# Altium project PCB2A.PrjPcb
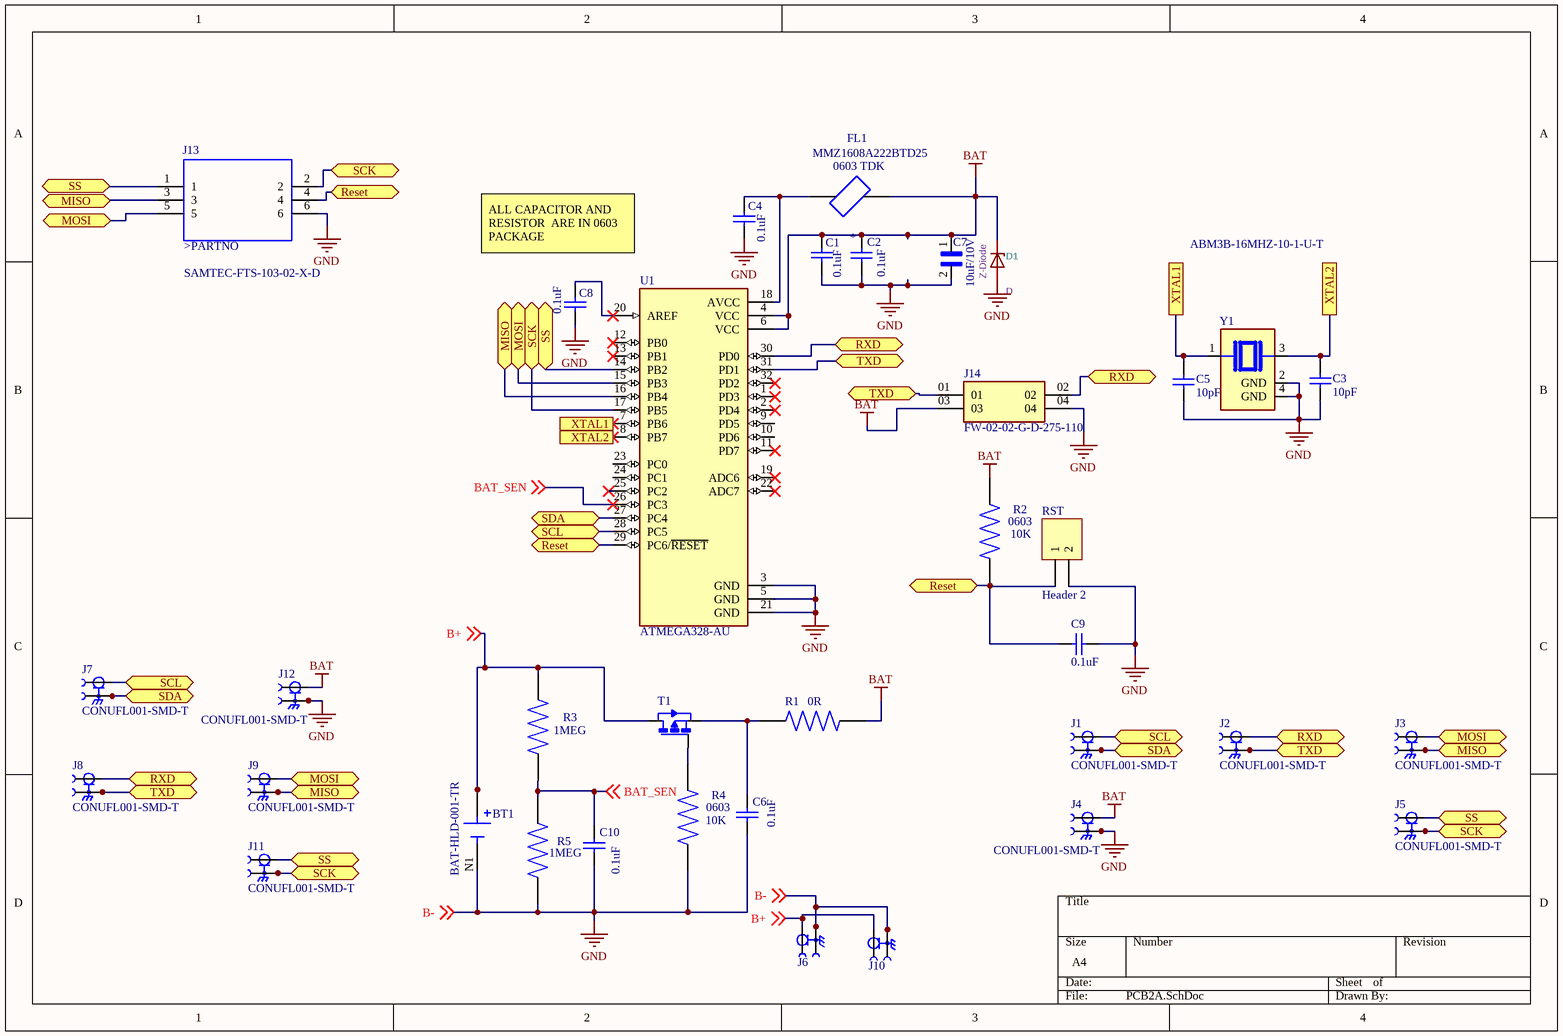
[diagram p0: PCB2A.SchDoc]
1 sheet, 36 parts. Net scope: flat (ports and power ports of the same name join across sheets).
Board file: PCB2A.PcbDoc

## Sheet PCB2A.SchDoc
size A4; SheetNumber: 1; SheetTotal: 1

### Parts
BT1  BAT-HLD-001-TR  [BAT_BAT-HLD-001-TR]
C1  value 0.1uF  [CAPC1608X90]  (hidden comment: Cap)
C2  value 0.1uF  [CAPC1608X90]  (hidden comment: Cap)
C3  value 10pF  [CAPC1608X90]  (hidden comment: Cap)
C4  value 0.1uF  [CAPC1608X90]  (hidden comment: Cap)
C5  value 10pF  [CAPC1608X90]  (hidden comment: Cap)
C6  value 0.1uF  [CAPC1608X90]  (hidden comment: Cap)
C7  10uF/10V  [CAPC1608X90]
C8  value 0.1uF  [CAPC1608X90]  (hidden comment: Cap)
C9  value 0.1uF  [CAPC1608X90]  (hidden comment: Cap)
C10  value 0.1uF  [CAPC1608X90]  (hidden comment: Cap)
D1  value Z-Diode  Reference: D  [SOD-323F]  (hidden comment: Zener-Diode)
FL1  MMZ1608A222BTD25  Package: 0603 TDK  [BEADC1608X95N]
J1  CONUFL001-SMD-T  [LINX_CONUFL001-SMD-T]
J2  CONUFL001-SMD-T  [LINX_CONUFL001-SMD-T]
J3  CONUFL001-SMD-T  [LINX_CONUFL001-SMD-T]
J4  CONUFL001-SMD-T  [LINX_CONUFL001-SMD-T]
J5  CONUFL001-SMD-T  [LINX_CONUFL001-SMD-T]
J6  CONUFL001-SMD-T  [LINX_CONUFL001-SMD-T]  (value not drawn)
J7  CONUFL001-SMD-T  [LINX_CONUFL001-SMD-T]
J8  CONUFL001-SMD-T  [LINX_CONUFL001-SMD-T]
J9  CONUFL001-SMD-T  [LINX_CONUFL001-SMD-T]
J10  CONUFL001-SMD-T  [LINX_CONUFL001-SMD-T]  (value not drawn)
J11  CONUFL001-SMD-T  [LINX_CONUFL001-SMD-T]
J12  CONUFL001-SMD-T  [LINX_CONUFL001-SMD-T]
J13  SAMTEC-FTS-103-02-X-D  [SAMTEC-FTS-103-02-X-D]  (value not drawn)
J14  FW-02-02-G-D-275-110  [SAMTEC_FW-02-02-G-D-275-110]
R1  value 0R  [RESC1608X55N]  (hidden comment: 10K)
R2  Package: 0603  [RESC1608X55N]  (hidden comment: 10K)
R3  value 1MEG  [RESC1608X55N]  (hidden comment: 10K)
R4  Package: 0603  [RESC1608X55N]  (hidden comment: 10K)
R5  value 1MEG  [RESC1608X55N]  (hidden comment: 10K)
RST  Header 2  [HDR1X2]
T1  SSM3J338R,LF  [SSM3J338R,LF]  (value not drawn)
U1  ATMEGA328-AU  [QFP80P900X900X120-32N]
Y1  ABM3B-16MHZ-10-1-U-T  [XTAL_ABM3B-16MHZ-10-1-U-T]

### Ports
MISO (bidir), MOSI (bidir), Reset (bidir), RXD (bidir), SCK (bidir), SCL (bidir), SDA (bidir), SS (bidir), TXD (bidir), XTAL1, XTAL2

### Nets
BAT: C1.2 C2.2 C7.1 D1.K FL1.2 J4.1 J12.1 J14.03 R1.1 R2.2 U1.4(VCC) U1.6(VCC)
GND: BT1.N1(NEG) C1.1 C2.1 C3.1 C4.1 C5.1 C6.1 C7.2 C8.1 C9.1 C10.1 D1.A J4.2 J4.3 J6.2 J6.3 J10.2 J10.3 J12.2 J12.3 J13.6 J14.04 R4.1 R5.1 RST.2 U1.3(GND) U1.5(GND) U1.21(GND) Y1.2(GND) Y1.4(GND) ; off-sheet B-  [also labelled B-]
B+: BT1.P1(POS) BT1.P2(POS) J6.1 J10.1 R3.2 T1.P$3(D) ; off-sheet B+
BAT_SEN: C10.2 R3.1 R5.2 U1.26(PC3) ; off-sheet BAT_SEN
NetC3_2: C3.2 U1.8(PB7) Y1.3 ; port XTAL2
NetC4_2: C4.2 FL1.1 U1.18(AVCC)
NetC5_2: C5.2 U1.7(PB6) Y1.1 ; port XTAL1
NetC6_2: C6.2 R1.2 T1.P$2(S)
NetC8_2: C8.2 U1.20(AREF)
NetC9_2: C9.2 J13.4 R2.1 RST.1 U1.29(PC6/~{RESET}) ; port Reset
NetJ1_1: J1.1 J7.1 U1.28(PC5) ; port SCL
NetJ1_2: J1.2 J1.3 J7.2 J7.3 U1.27(PC4) ; port SDA
NetJ2_1: J2.1 J8.1 J14.02 U1.30(PD0) ; port RXD
NetJ2_2: J2.2 J2.3 J8.2 J8.3 J14.01 U1.31(PD1) ; port TXD
NetJ3_1: J3.1 J9.1 J13.5 U1.15(PB3) ; port MOSI
NetJ3_2: J3.2 J3.3 J9.2 J9.3 J13.3 U1.16(PB4) ; port MISO
NetJ5_1: J5.1 J11.1 J13.1 U1.14(PB2) ; port SS
NetJ5_2: J5.2 J5.3 J11.2 J11.3 J13.2 U1.17(PB5) ; port SCK
NetR4_2: R4.2 T1.P$1(G)

Not connected (* = marked no-connect by the designer): U1 1(PD3)* 2(PD4)* 9(PD5) 10(PD6) 11(PD7)* 12(PB0)* 13(PB1)* 19(ADC6)* 22(ADC7)* 23(PC0) 24(PC1) 25(PC2)* 32(PD2)*

### Notes on the sheet
- ALL CAPACITOR AND RESISTOR  ARE IN 0603 PACKAGE
- (in symbol SAMTEC-FTS-103-02-X-D) >PARTNO

### Library data of the parts
BT1 = BAT-HLD-001-TR: Battery Retainer Coin, 20.0mm 1 Cell SMD (SMT) Tab; Availability: Unavailable; Package: None; MP: BAT-HLD-001-TR; Value: *; Price: None
C1-C6 C8-C10 = Cap: Capacitor; Published: 8-Jun-2000; LatestRevisionDate: 17-Jul-2002; LatestRevisionNote: Re-released for DXP Platform.; PackageReference: RAD-0.3; Publisher: Altium Limited; PackageDescription: Radial Cap, Thru-Hole; 2 Leads; 0.3 in Pin Spacing
C7 = CC0603MRX5R7BB106: CAP CER 10UF 16V X5R 0603; Package: None; Price: None; Value: *; MP: CC0603MRX5R7BB106; Availability: Unavailable
D1 = Zener-Diode: ki_keywords: Zener TVS unidirectional Diode; ki_description: Zener Diode, TVS-unidirectional Diode; Datasheet: https://diotec.com/de/produktliste/Z.html
FL1 = MMZ1608A222BTD25: Ferrite Beads Multi-Layer 2.2KOhm 25% 100MHz 0.2A 0.8Ohm DCR 0603 Automotive T/R; MF: TDK; SnapEDA_Link: https://www.snapeda.com/parts/MMZ1608A222BTD25/TDK/view-part/2727619/?ref=snap; Availability: Good; MP: MMZ1608A222BTD25; Price: None; Purchase-URL: https://pricing.snapeda.com/search/part/MMZ1608A222BTD25/?ref=eda; Value: *; Check_prices: https://www.snapeda.com/parts/MMZ1608A222BTD25/TDK/view-part/2727619/?ref=eda
J1-J12 = CONUFL001-SMD-T: U.FL (UMCC) Connector Jack, Male Pin 50Ohm Surface Mount Solder; MF: Linx; Price: None; MP: CONUFL001-SMD-T; Package: None; Value: *; Check_prices: https://www.snapeda.com/parts/CONUFL001-SMD-T/Linx/view-part/?ref=eda; Availability: Unavailable; SnapEDA_Link: https://www.snapeda.com/parts/CONUFL001-SMD-T/Linx/view-part/?ref=snap
J13 = SAMTEC-FTS-103-02-X-D: MF: Samtec; MP: SAMTEC-FTS-103-02-X-D; Package: None; Price: None; Availability: Unavailable; Value: *
J14 = FW-02-02-G-D-275-110: Conn Board Stacker HDR 4 POS 1.27mm Solder ST Top Entry Thru-Hole Layer; MF: Samtec; SnapEDA_Link: https://www.snapeda.com/parts/FW-02-02-G-D-275-110/Samtec/view-part/?ref=snap; Package: None; Value: *; MP: FW-02-02-G-D-275-110; Check_prices: https://www.snapeda.com/parts/FW-02-02-G-D-275-110/Samtec/view-part/?ref=eda
R1-R5 = RT0603FRD0710KL: Res Thin Film 0603 10K Ohm 1% 0.1W(1/10W) Â±25ppm/C Molded SMD Paper T/R; MF: Yageo; MP: RT0603FRD0710KL; Price: None; Purchase-URL: https://pricing.snapeda.com/search/part/RT0603FRD0710KL/?ref=eda; Check_prices: https://www.snapeda.com/parts/RT0603FRD0710KL/Yageo/view-part/?ref=eda; Availability: In Stock; SnapEDA_Link: https://www.snapeda.com/parts/RT0603FRD0710KL/Yageo/view-part/?ref=snap
  R1 R3 R5: Package: 0603
  R2 R4: Value: 10K
RST = Header 2: Header, 2-Pin; LatestRevisionDate: 17-Jul-2002; LatestRevisionNote: Re-released for DXP Platform.; Publisher: Altium Limited
T1 = SSM3J338R,LF: P-Channel 12 V 6A (Ta) 1W (Ta) Surface Mount SOT-23F; MF: Toshiba Semiconductor and Storage; Availability: In Stock; SnapEDA_Link: https://www.snapeda.com/parts/SSM3J338R,LF/Toshiba+Semiconductor+and+Storage/view-part/?ref=snap; Value: *; MP: SSM3J338R,LF; Package: SOT-23-3 Toshiba Semiconductor and Storage; Price: None; Purchase-URL: https://pricing.snapeda.com/search/part/SSM3J338R,LF/?ref=eda; Check_prices: https://www.snapeda.com/parts/SSM3J338R,LF/Toshiba+Semiconductor+and+Storage/view-part/?ref=eda
U1 = ATMEGA328-AU: AVR AVRÂ® ATmega Microcontroller IC 8-Bit 20MHz 32KB (16K x 16) FLASH 32-TQFP (7x7); MF: Microchip; Check_prices: https://www.snapeda.com/parts/ATMEGA328-AU/Microchip/view-part/?ref=eda; Value: *; Availability: In Stock; MP: ATMEGA328-AU; Price: None; Package: TQFP-32 Microchip; SnapEDA_Link: https://www.snapeda.com/parts/ATMEGA328-AU/Microchip/view-part/?ref=snap; Purchase-URL: https://pricing.snapeda.com/search/part/ATMEGA328-AU/?ref=eda
Y1 = ABM3B-16MHZ-10-1-U-T: Crystals 16.0 MHZ 10PF; MF: ABRACON; SnapEDA_Link: https://www.snapeda.com/parts/ABM3B-16MHZ-10-1-U-T/Abracon/view-part/?ref=snap; Package: SMD-4 Abracon LLC; Value: *; MP: ABM3B-16MHZ-10-1-U-T; Check_prices: https://www.snapeda.com/parts/ABM3B-16MHZ-10-1-U-T/Abracon/view-part/?ref=eda